# EAGLE design beaglebone black cape (EAGLE 6.6.0)

## Sheet 1 of 3
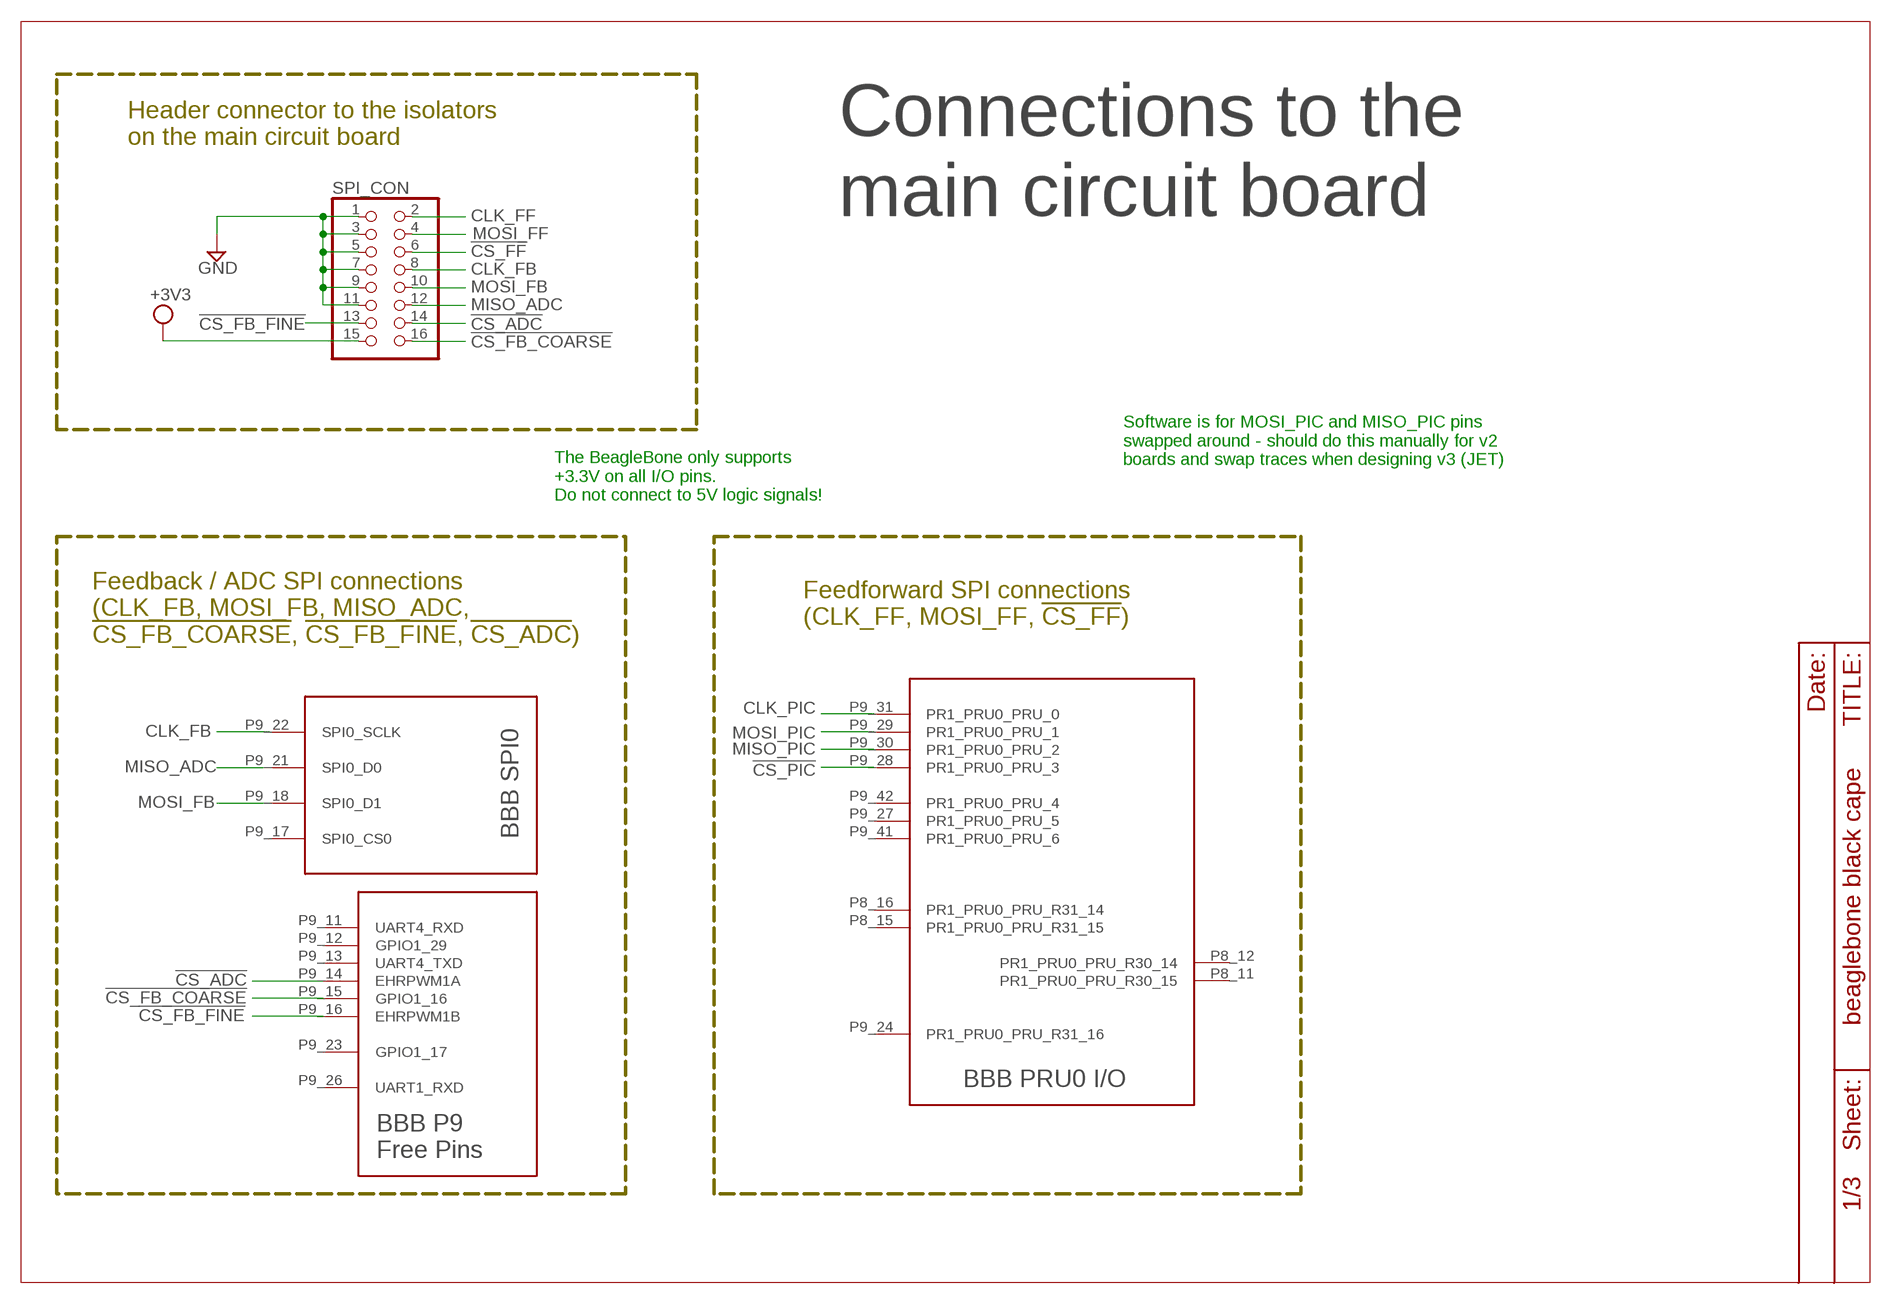
[diagram p0: schematic, sheet 1]

### Parts
SPI_CON  HEADER-2X8  [HEADER-2X8-BOX]
U$1  BEAGLEBONE_BLACK  [BEAGLEBONE_BLACK]

### Nets
3V3: SPI_CON.15 ; supply symbol labelled +3V3 ; also sheet 2,3
!CS_ADC: SPI_CON.14 U$1.P9_14(EHRPWM1A)
!CS_FB_COARSE: SPI_CON.16 U$1.P9_15(GPIO1_16)
!CS_FB_FINE: SPI_CON.13 U$1.P9_16(EHRPWM1B)
!CS_FF: SPI_CON.6 ; also sheet 3
!CS_PIC: U$1.P9_28(PR1_PRU0_PRU_3)
CLK_FB: SPI_CON.8 U$1.P9_22(SPI0_SCLK)
CLK_FF: SPI_CON.2 ; also sheet 3
CLK_PIC: U$1.P9_31(PR1_PRU0_PRU_0) ; also sheet 3
GND: SPI_CON.1 SPI_CON.3 SPI_CON.5 SPI_CON.7 SPI_CON.9 SPI_CON.11 ; also sheet 2,3
MISO_ADC: SPI_CON.12 U$1.P9_21(SPI0_D0)
MISO_PIC: U$1.P9_30(PR1_PRU0_PRU_2) ; also sheet 3
MOSI_FB: SPI_CON.10 U$1.P9_18(SPI0_D1)
MOSI_FF: SPI_CON.4 ; also sheet 3
MOSI_PIC: U$1.P9_29(PR1_PRU0_PRU_1) ; also sheet 3
Unconnected: U$1.P8_3(MMC1_DAT6) U$1.P8_4(MMC1_DAT7) U$1.P8_5(MMC1_DAT2) U$1.P8_6(MMC1_DAT3) U$1.P8_7(TIMER4) U$1.P8_8(TIMER7) U$1.P8_9(TIMER5) U$1.P8_10(TIMER6) U$1.P8_11(PR1_PRU0_PRU_R30_15) U$1.P8_12(PR1_PRU0_PRU_R30_14) U$1.P8_13(EHRPWM2B) U$1.P8_14(GPIO0_26) U$1.P8_15(PR1_PRU0_PRU_R31_15) U$1.P8_16(PR1_PRU0_PRU_R31_14) U$1.P8_17(GPIO0_27) U$1.P8_18(GPIO2_1) U$1.P8_19(EHRPWM2A) U$1.P8_20(MMC1_CMD) U$1.P8_21(MMC1_CLK) U$1.P8_22(MMC1_DAT5) U$1.P8_23(MMC1_DAT4) U$1.P8_24(MMC1_DAT1) U$1.P8_25(MMC1_DAT0) U$1.P8_26(GPIO1_29) U$1.P8_27(LCD_VSYNC) U$1.P8_28(LCD_PCLK) U$1.P8_29(LCD_HSYNC) U$1.P8_30(LCD_AC_BIAS_EN) U$1.P8_31(LCD_DATA14) U$1.P8_32(LCD_DATA15) U$1.P8_33(LCD_DATA13) U$1.P8_34(LCD_DATA11) U$1.P8_35(LCD_DATA12) U$1.P8_36(LCD_DATA10) U$1.P8_37(LCD_DATA8) U$1.P8_38(LCD_DATA9) U$1.P8_39(LCD_DATA6) U$1.P8_40(LCD_DATA7) U$1.P8_41(LCD_DATA4) U$1.P8_42(LCD_DATA5) U$1.P8_43(LCD_DATA2) U$1.P8_44(LCD_DATA3) U$1.P8_45(LCD_DATA0) U$1.P8_46(LCD_DATA1) U$1.P9_11(UART4_RXD) U$1.P9_12(GPIO1_29) U$1.P9_13(UART4_TXD) U$1.P9_17(SPI0_CS0) U$1.P9_19(I2C2_SCL) U$1.P9_20(I2C2_SDA) U$1.P9_23(GPIO1_17) U$1.P9_24(PR1_PRU0_PRU_R31_16) U$1.P9_25(AUDIO_CLK_IN) U$1.P9_26(UART1_RXD) U$1.P9_27(PR1_PRU0_PRU_5) U$1.P9_33(AIN4) U$1.P9_35(AIN6) U$1.P9_36(AIN5) U$1.P9_37(AIN2) U$1.P9_38(AIN3) U$1.P9_39(AIN0) U$1.P9_40(AIN1) U$1.P9_41(PR1_PRU0_PRU_6) U$1.P9_42(PR1_PRU0_PRU_4)

### Notes on the sheet
- Header connector to the isolators 
  on the main circuit board
- Connections to the 
  main circuit board
- Software is for MOSI_PIC and MISO_PIC pins
  swapped around - should do this manually for v2
  boards and swap traces when designing v3 (JET)
- The BeagleBone only supports 
  +3.3V on all I/O pins. 
  Do not connect to 5V logic signals!
- Feedforward SPI connections
  (CLK_FF, MOSI_FF, !CS_FF!)
- Feedback / ADC SPI connections
  (CLK_FB, MOSI_FB, MISO_ADC, 
  !CS_FB_COARSE!, !CS_FB_FINE!, !CS_ADC!)

## Sheet 2 of 3
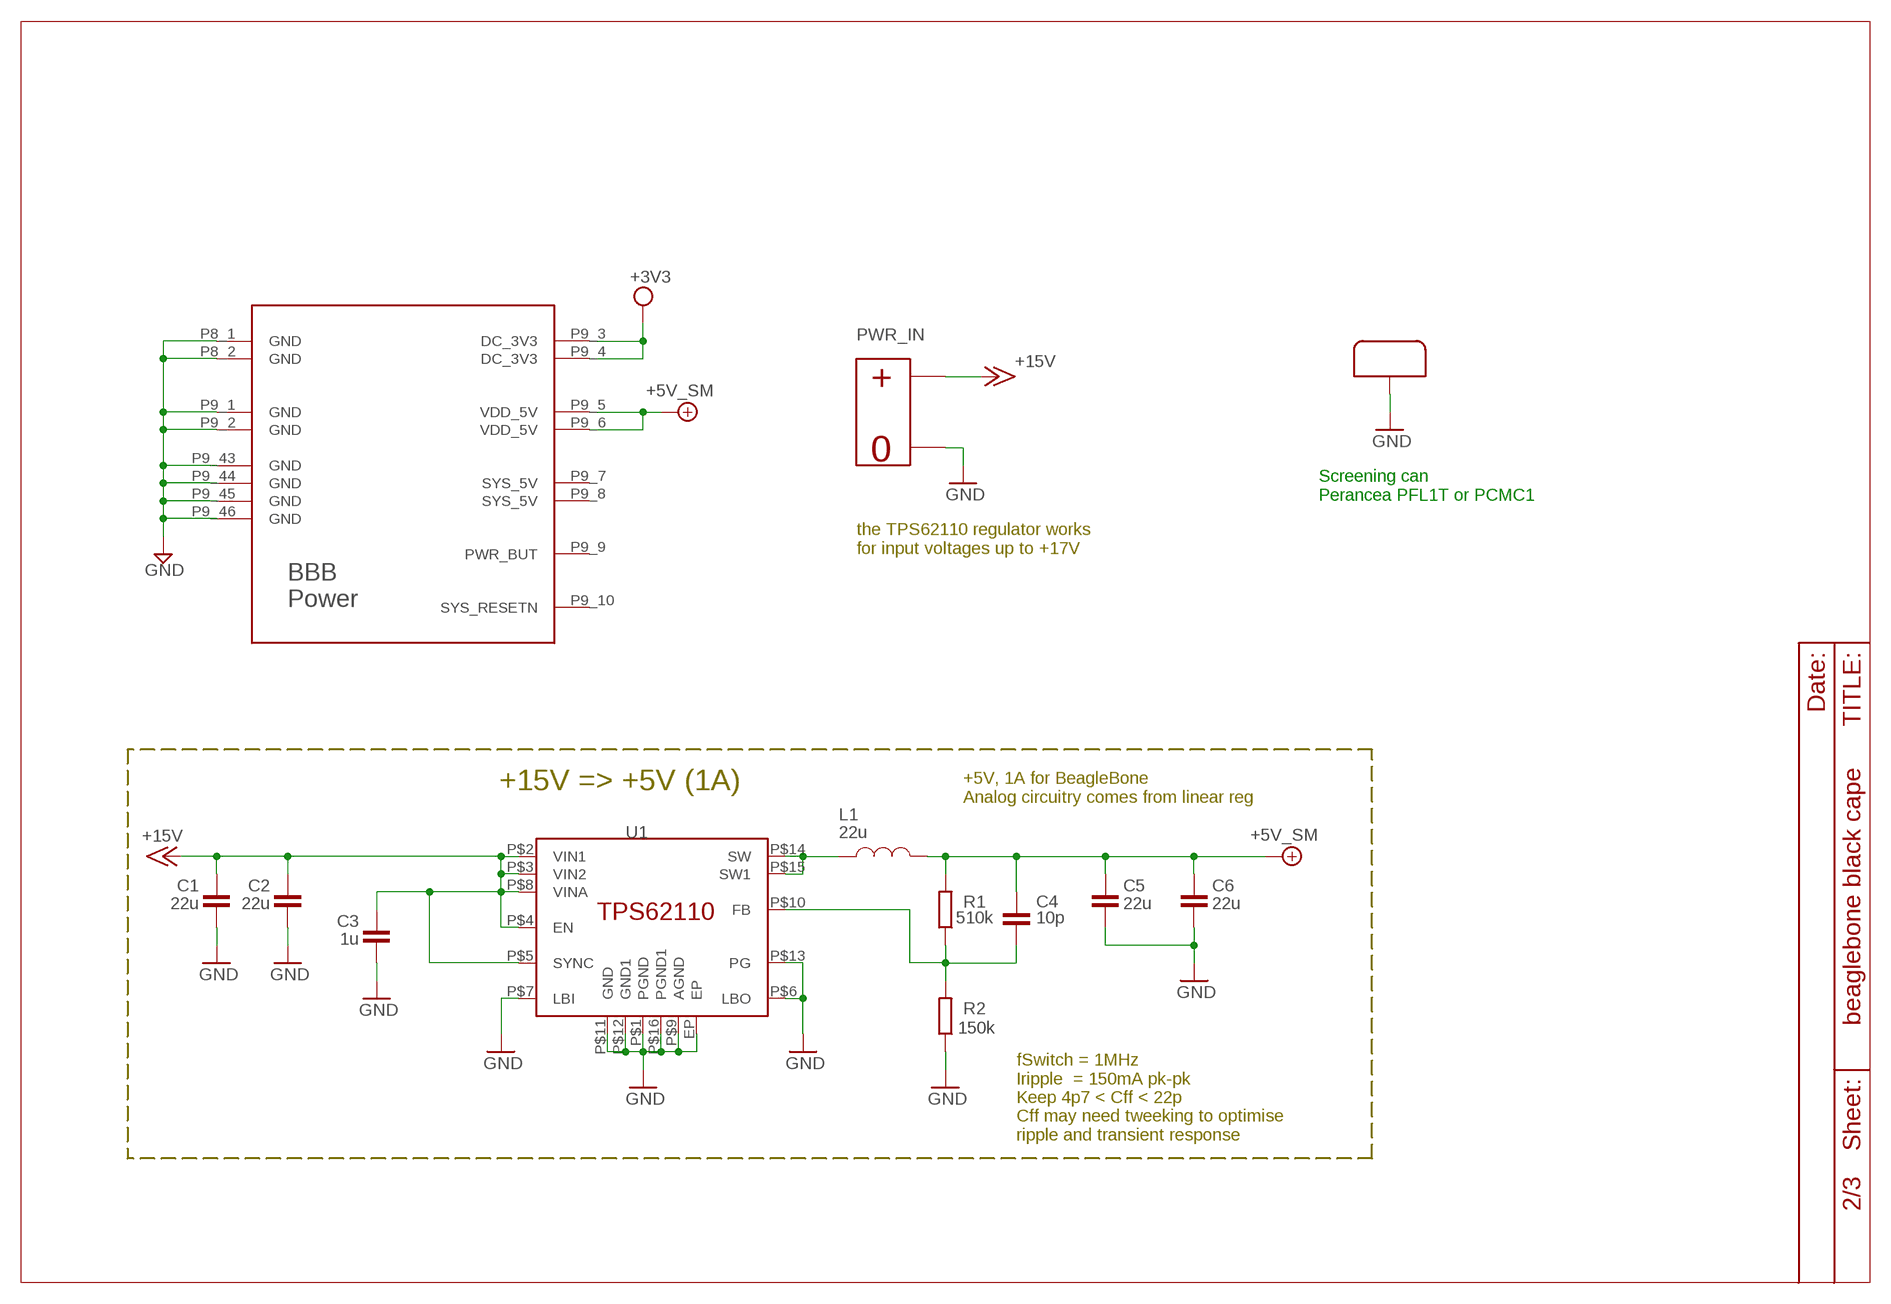
[diagram p1: schematic, sheet 2]

### Parts
C1  22u  CAP0805  [0805]
C2  22u  CAP0805  [0805]
C3  1u  CAP0805  [0805]
C4  10p  CAP0603  [0603]
C5  22u  CAP0805  [0805]
C6  22u  CAP0805  [0805]
L1  22u  INDUCTORXAL6060  [XAL6060]
PWR_IN  MOLEX_POWER_2PIN  [MOLEX-2PIN]
R1  510k  RES0603  [0603]
R2  150k  RES0603  [0603]
U1  TPS62110  [QFN16_4]
U$2  SCREENING_CAN  [SCREENING_CAN_20X20]

### Nets
3V3: U$1.P9_3(DC_3V3) U$1.P9_4(DC_3V3) ; supply symbol labelled +3V3 ; also sheet 1,3
+5VSM: C4.1 C5.1 C6.1 L1.P$2(P2) R1.2 U$1.P9_5(VDD_5V) U$1.P9_6(VDD_5V) ; supply symbol labelled +5V_SM
+15V: C1.1 C2.1 C3.1 PWR_IN.2(+) U1.P$2(VIN1) U1.P$3(VIN2) U1.P$4(EN) U1.P$5(SYNC) U1.P$8(VINA)
GND: C1.2 C2.2 C3.2 C5.2 C6.2 PWR_IN.1(GND) R2.1 U1.EP U1.P$1(PGND) U1.P$6(LBO) U1.P$7(LBI) U1.P$9(AGND) U1.P$11(GND) U1.P$12(GND1) U1.P$13(PG) U1.P$16(PGND1) U$1.P8_1(GND) U$1.P8_2(GND) U$1.P9_1(GND) U$1.P9_2(GND) U$1.P9_43(GND) U$1.P9_44(GND) U$1.P9_45(GND) U$1.P9_46(GND) U$2.1 U$2.2 U$2.3 U$2.4 ; also sheet 1,3
N$192: L1.P$1(P1) U1.P$14(SW) U1.P$15(SW1)
N$193: C4.2 R1.1 R2.2 U1.P$10(FB)

### Notes on the sheet
- Screening can
  Perancea PFL1T or PCMC1
- the TPS62110 regulator works 
  for input voltages up to +17V
- +15V => +5V (1A)
- +5V, 1A for BeagleBone
  Analog circuitry comes from linear reg
- fSwitch = 1MHz
  Iripple  = 150mA pk-pk
  Keep 4p7 < Cff < 22p
  Cff may need tweeking to optimise
  ripple and transient response

## Sheet 3 of 3
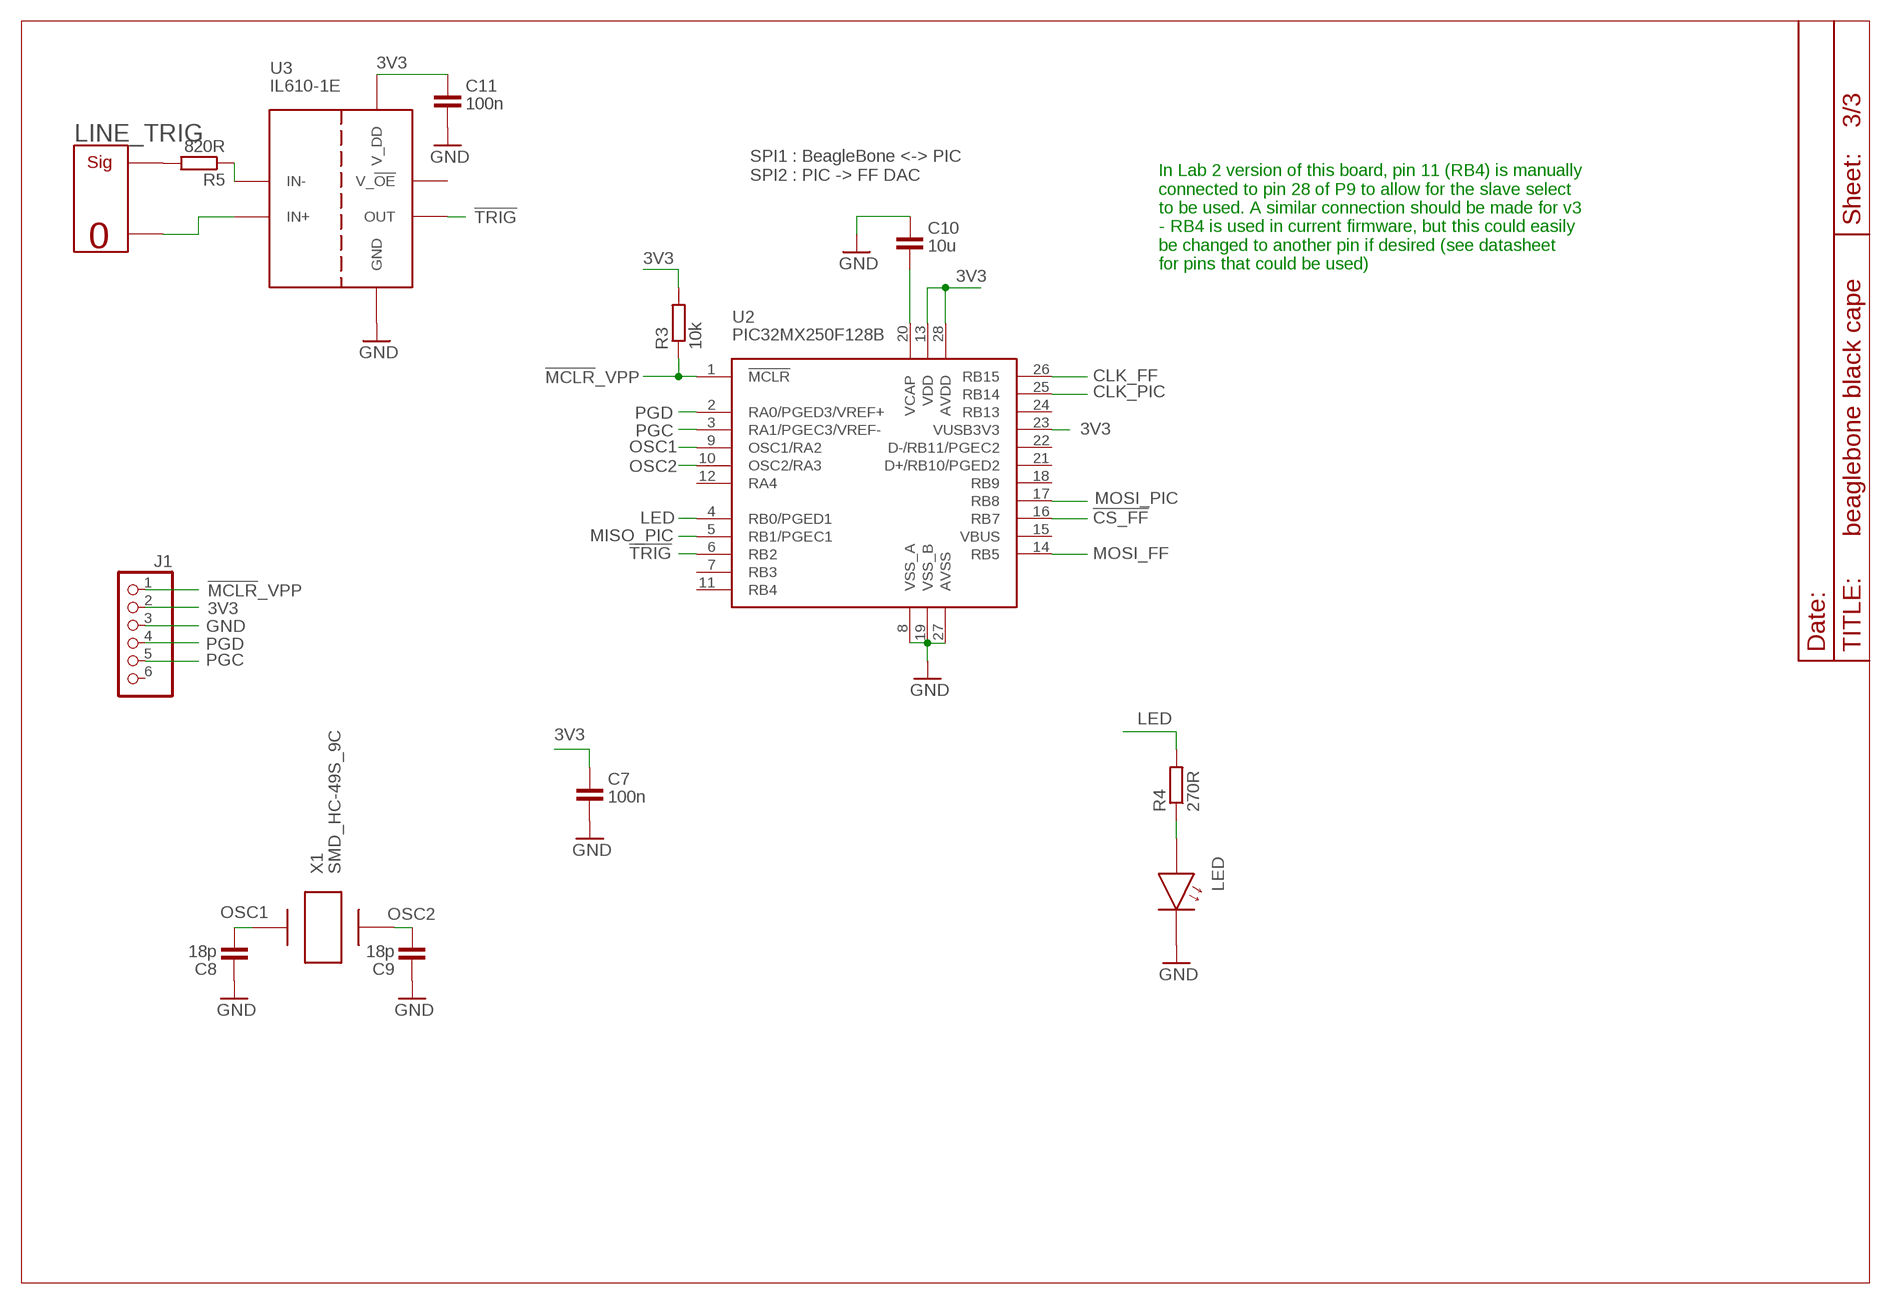
[diagram p2: schematic, sheet 3]

### Parts
C7  100n  CAP0603  [0603]
C8  18p  CAP0603  [0603]
C9  18p  CAP0603  [0603]
C10  10u  CAP0805  [0805]
C11  100n  CAP0603  [0603]
J1  HEADER-1X6  [1X06]
LED  OSRAMLED  [0805DIODE]
LINE_TRIG  MOLEX_SIG_2PIN  [MOLEX-2PIN]
R3  10k  RES0603  [0603]
R4  270R  RES0603  [0603]
R5  820R  RES0603  [0603]
U2  PIC32MX250F128B  [SSOP28]
U3  IL610-1E  [MSOP8]
X1  SMD_HC-49S_9C  [SMD_HC-49S_9C]

### Nets
3V3: C7.1 C11.1 J1.2 R3.2 U2.13(VDD) U2.23(VUSB3V3) U2.28(AVDD) U3.8(V_DD) ; also sheet 1,2
!CS_FF: U2.16(RB7) ; also sheet 1
!MCLR!_VPP: J1.1 R3.1 U2.1(!MCLR)
!TRIG: U2.6(RB2) U3.6(OUT)
CLK_FF: U2.26(RB15) ; also sheet 1
CLK_PIC: U2.25(RB14) ; also sheet 1
GND: C7.2 C8.1 C9.1 C10.1 C11.2 J1.3 LED.2 LINE_TRIG.1(GND) U2.8(VSS_A) U2.19(VSS_B) U2.27(AVSS) U3.2(IN+) U3.5(GND) ; also sheet 1,2
LED: R4.2 U2.4(RB0/PGED1)
MISO_PIC: U2.5(RB1/PGEC1) ; also sheet 1
MOSI_FF: U2.14(RB5) ; also sheet 1
MOSI_PIC: U2.17(RB8) ; also sheet 1
N$1: LED.1 R4.1
N$2: R5.1 U3.3(IN-)
N$7: LINE_TRIG.2(SIG) R5.2
OSC1: C8.2 U2.9(OSC1/RA2) X1.P$2
OSC2: C9.2 U2.10(OSC2/RA3) X1.P$1
PGC: J1.5 U2.3(RA1/PGEC3/VREF-)
PGD: J1.4 U2.2(RA0/PGED3/VREF+)
VCAP: C10.2 U2.20(VCAP)
Unconnected: J1.6 U2.7(RB3) U2.11(RB4) U2.12(RA4) U2.15(VBUS) U2.18(RB9) U2.21(D+/RB10/PGED2) U2.22(D-/RB11/PGEC2) U2.24(RB13) U3.7(V_!OE)

### Notes on the sheet
- SPI1 : BeagleBone <-> PIC
  SPI2 : PIC -> FF DAC
- In Lab 2 version of this board, pin 11 (RB4) is manually
  connected to pin 28 of P9 to allow for the slave select
  to be used. A similar connection should be made for v3
  - RB4 is used in current firmware, but this could easily
  be changed to another pin if desired (see datasheet
  for pins that could be used)

## Power pins joined to a net without a drawn wire
AGND: U$1.P9_34(AGND)
PWR_BUT: U$1.P9_9(PWR_BUT)
SYS_5V: U$1.P9_7(SYS_5V) U$1.P9_8(SYS_5V)
SYS_RESETN: U$1.P9_10(SYS_RESETN)
VADC: U$1.P9_32(VADC)

## Library data of the parts
C1-C11 = custom-passive:CAP: capacitor
J1 = custom-con:HEADER-1X6
L1 = custom-passive:INDUCTOR: Inductors, mainly Coilcraft.
LED = custom:OSRAMLED
LINE_TRIG = custom-con:MOLEX_SIG_2PIN: 2 pin Molex KK connector for 1 signal puls GND.
PWR_IN = custom-con:MOLEX_POWER_2PIN
R1-R5 = custom-passive:RES
SPI_CON = custom-con:HEADER-2X8
U1 = custom-ic:TPS62110: Texas Instruments TS62110 3.1V-17V input, 1.2V-16V out, 1.5A synchronous step-down DC-to-DC converter.
U2 = custom-ic:PIC32MX250F128B: Microcontroller (Farnell part number: 2382711)
U3 = custom-ic:IL610-1E: Single-channel isolator (Digikey part number: 390-1075-5-ND)
U$1 = custom-module:BEAGLEBONE_BLACK: BeagleBone Black cape with explicit support for eMMC, HDMI, IC2C, SPI0, and remaining PRU0 pins
U$2 = custom:SCREENING_CAN
X1 = custom-passive:SMD_HC-49S_9C: SMD HC-49S 9C series quartz crystal (e.g. Farnell part number: 1842314).

## Board
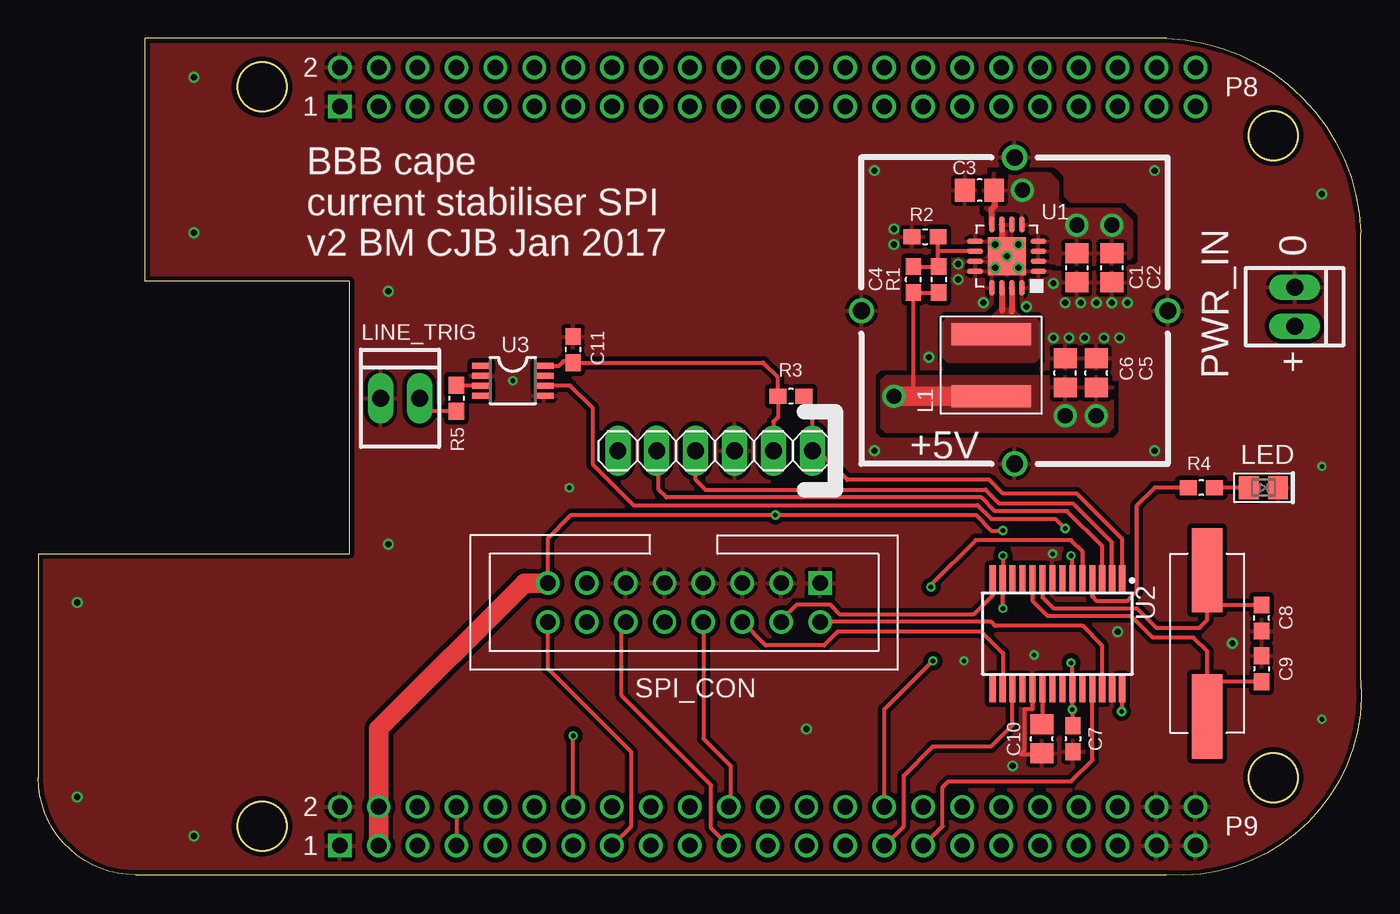
[diagram p3: board, top side]
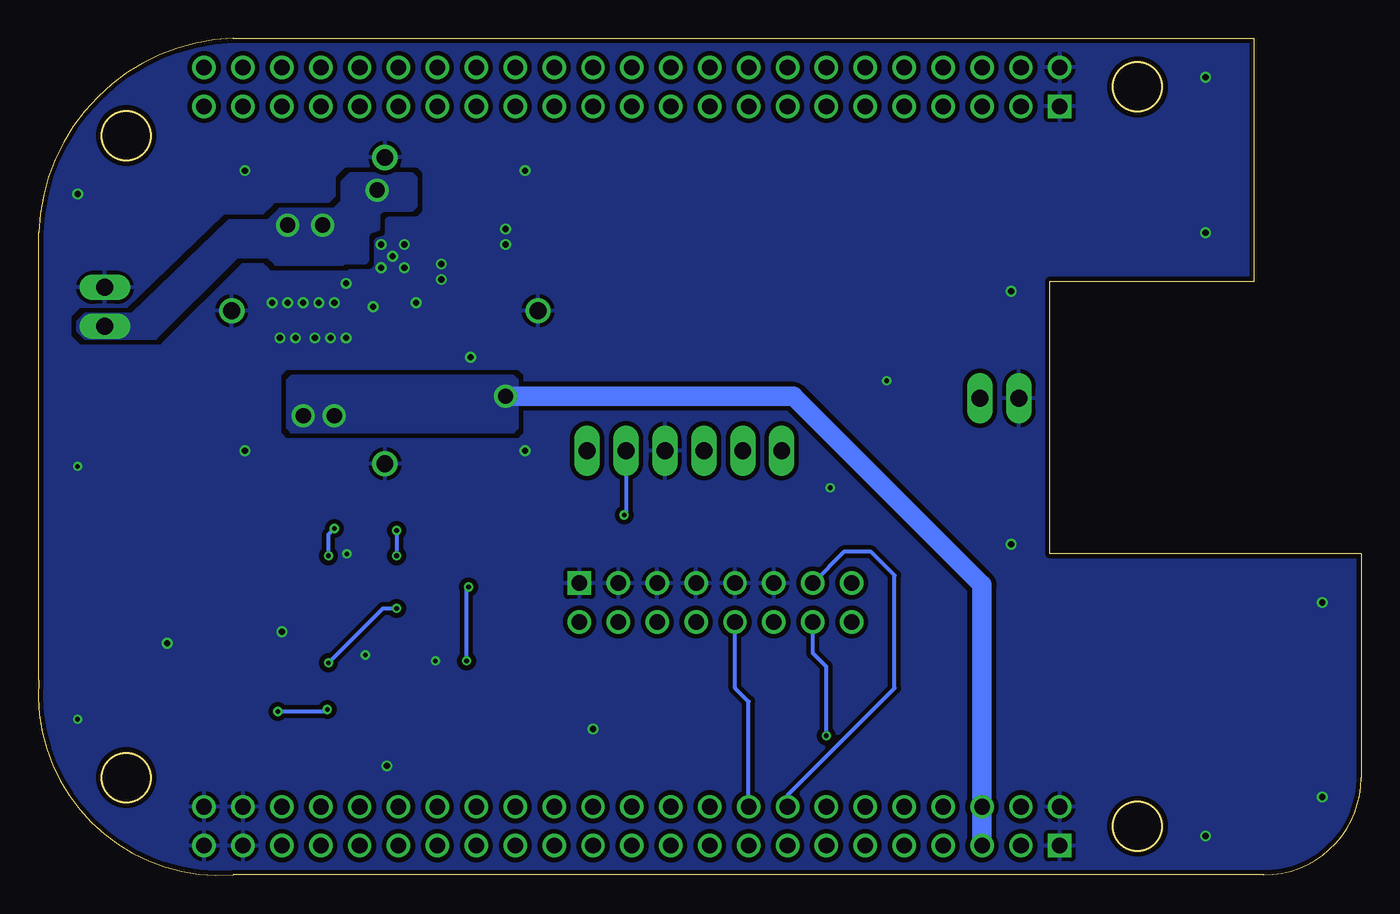
[diagram p4: board, bottom side, seen from below]

Size 86.39 x 54.64 mm. Coordinates in mm from the lower left corner, seen from the top.
Copper layers (1*16): Top 0.035mm / dielectric 1.5mm / Bottom 0.035mm
Design rules "ITEADstudio_DRC": minimum track width 6mil, minimum drill 0.3mm, track to track 6mil, track to pad 6mil, pad to pad 6mil, via to via 6mil, smd to smd 0mil, copper to edge 0.2mm, drill to drill 10mil, minimum pad ring 10mil, minimum via ring 6mil, stop-mask expansion 2mil, vias tented up to drill 100mil, thermal gap 10mil

### Footprints (pad centres in the part's own frame; a part is rotated, then mirrored left to right if it is on the bottom)
0805 = smd 1.3 x 1.5: 1 -0.95,0; 2 0.95,0
0603 = smd 1.1 x 1: 1 -0.85,0; 2 0.85,0
1X06 = drill 1.1 long: 1 -6.35,0; 2 -3.81,0; 3 -1.27,0; 4 1.27,0; 5 3.81,0; 6 6.35,0
XAL6060 = smd 1.43 x 5.18: P$1 -2.02,0; P$2 2.02,0
0805DIODE = smd 1.3 x 1.5: 1 -0.95,0; 2 0.95,0
MOLEX-2PIN = drill 1.1 long: 1 -1.27,0; 2 1.27,0
HEADER-2X8-BOX = drill 1.02 square: 1 -8.89,-1.27 | drill 1.02: 2 -8.89,1.27; 3 -6.35,-1.27; 4 -6.35,1.27; 5 -3.81,-1.27; 6 -3.81,1.27; 7 -1.27,-1.27; 8 -1.27,1.27; 9 1.27,-1.27; 10 1.27,1.27; 11 3.81,-1.27; 12 3.81,1.27; 13 6.35,-1.27; 14 6.35,1.27; 15 8.89,-1.27; 16 8.89,1.27
QFN16_4 = smd 2.5 x 2.5: EP 0,0 | smd 1.025 x 0.35: P$1 -2.062,0.975; P$2 -2.062,0.325; P$3 -2.062,-0.325; P$4 -2.062,-0.975; P$9 2.062,-0.975; P$10 2.062,-0.325; P$11 2.062,0.325; P$12 2.062,0.975 | smd 0.35 x 1.025: P$5 -0.975,-2.062; P$6 -0.325,-2.062; P$7 0.325,-2.062; P$8 0.975,-2.062; P$13 0.975,2.062; P$14 0.325,2.062; P$15 -0.325,2.062; P$16 -0.975,2.062
SSOP28 = smd 1.75 x 0.4: 1 -3.6,4.225; 2 -3.6,3.575; 3 -3.6,2.925; 4 -3.6,2.275; 5 -3.6,1.625; 6 -3.6,0.975; 7 -3.6,0.325; 8 -3.6,-0.325; 9 -3.6,-0.975; 10 -3.6,-1.625; 11 -3.6,-2.275; 12 -3.6,-2.925; 13 -3.6,-3.575; 14 -3.6,-4.225; 15 3.6,-4.225; 16 3.6,-3.575; 17 3.6,-2.925; 18 3.6,-2.275; 19 3.6,-1.625; 20 3.6,-0.975; 21 3.6,-0.325; 22 3.6,0.325; 23 3.6,0.975; 24 3.6,1.625; 25 3.6,2.275; 26 3.6,2.925; 27 3.6,3.575; 28 3.6,4.225
MSOP8 = smd 0.4 x 1.2: 1 -0.975,-2.05; 2 -0.325,-2.05; 3 0.325,-2.05; 4 0.975,-2.05; 5 0.975,2.05; 6 0.325,2.05; 7 -0.325,2.05; 8 -0.975,2.05
BEAGLEBONE_BLACK = drill 1.02 square: P8_1 19.685,50.165; P9_1 19.685,1.905 | drill 1.02: P8_2 19.685,52.705; P8_3 22.225,50.165; P8_4 22.225,52.705; P8_5 24.765,50.165; P8_6 24.765,52.705; P8_7 27.305,50.165; P8_8 27.305,52.705; P8_9 29.845,50.165; P8_10 29.845,52.705; P8_11 32.385,50.165; P8_12 32.385,52.705; P8_13 34.925,50.165; P8_14 34.925,52.705; P8_15 37.465,50.165; P8_16 37.465,52.705; P8_17 40.005,50.165; P8_18 40.005,52.705; P8_19 42.545,50.165; P8_20 42.545,52.705; P8_21 45.085,50.165; P8_22 45.085,52.705; P8_23 47.625,50.165; P8_24 47.625,52.705; P8_25 50.165,50.165; P8_26 50.165,52.705; P8_27 52.705,50.165; P8_28 52.705,52.705; P8_29 55.245,50.165; P8_30 55.245,52.705; P8_31 57.785,50.165; P8_32 57.785,52.705; P8_33 60.325,50.165; P8_34 60.325,52.705; P8_35 62.865,50.165; P8_36 62.865,52.705; P8_37 65.405,50.165; P8_38 65.405,52.705; P8_39 67.945,50.165; P8_40 67.945,52.705; P8_41 70.485,50.165; P8_42 70.485,52.705; P8_43 73.025,50.165; P8_44 73.025,52.705; P8_45 75.565,50.165; P8_46 75.565,52.705; P9_2 19.685,4.445; P9_3 22.225,1.905; P9_4 22.225,4.445; P9_5 24.765,1.905; P9_6 24.765,4.445; P9_7 27.305,1.905; P9_8 27.305,4.445; P9_9 29.845,1.905; P9_10 29.845,4.445; P9_11 32.385,1.905; P9_12 32.385,4.445; P9_13 34.925,1.905; P9_14 34.925,4.445; P9_15 37.465,1.905; P9_16 37.465,4.445; P9_17 40.005,1.905; P9_18 40.005,4.445; P9_19 42.545,1.905; P9_20 42.545,4.445; P9_21 45.085,1.905; P9_22 45.085,4.445; P9_23 47.625,1.905; P9_24 47.625,4.445; P9_25 50.165,1.905; P9_26 50.165,4.445; P9_27 52.705,1.905; P9_28 52.705,4.445; P9_29 55.245,1.905; P9_30 55.245,4.445; P9_31 57.785,1.905; P9_32 57.785,4.445; P9_33 60.325,1.905; P9_34 60.325,4.445; P9_35 62.865,1.905; P9_36 62.865,4.445; P9_37 65.405,1.905; P9_38 65.405,4.445; P9_39 67.945,1.905; P9_40 67.945,4.445; P9_41 70.485,1.905; P9_42 70.485,4.445; P9_43 73.025,1.905; P9_44 73.025,4.445; P9_45 75.565,1.905; P9_46 75.565,4.445
SCREENING_CAN_20X20 = drill 1.1: 1 -10,0; 2 0,-10; 3 10,0; 4 0,10
SMD_HC-49S_9C = smd 5.5 x 2: P$1 -4.775,0; P$2 4.775,0

### Placement (x,y rotation side)
C1  67.82,39.65 270 top
C2  70.1,39.65 270 top
C3  61.47,44.73 180 top
C4  57.15,38.89 90 top
C5  69.09,32.8 90 top
C6  67.06,32.8 90 top
C7  67.56,8.92 270 top
C8  79.88,16.79 90 top
C9  79.88,13.49 270 top
C10  65.53,8.92 90 top
C11  34.92,34.32 90 top
J1  44.2,27.72 180 top
L1  62.23,33.3 270 top
LED  80.01,25.3 0 top
LINE_TRIG  23.62,31.15 0 top
PWR_IN  82.04,37.11 270 top
R1  58.8,38.89 270 top
R2  57.91,41.69 0 top
R3  49.15,31.27 180 top
R4  75.95,25.3 180 top
R5  27.3,31.15 270 top
SPI_CON  42.16,17.81 180 top
U1  63.25,40.42 180 top
U2  66.55,15.78 270 top
U3  30.99,32.29 270 top
U$1  0,0.03 0 top
U$2  63.75,36.86 0 top
X1  76.33,15.14 90 top

### Tracks (layer width: path | path; a pad name or v marks a point on that pad's centre or on a via)
3V3  (via drill 0.3)
  Top 0.254: C7.1 67.52,9.81 v67.52,10.83 U2.23 67.52,13.79 v67.44,13.87 | U2.28 70.77,10.73 v70.74,10.7 | v62.99,17.43 62.97,17.45 U2.13 62.99,19.4 v62.99,20.86 | J1.2 48.01,29.62 48.3,29.91 R3.2 48.26,31.31 48.26,32.54 47.33,33.47 C11.1 34.84,33.56 34.29,33.56 33.99,33.26 U3.8 | v62.99,22.51 62.23,22.51 61.21,23.53 v48.13,23.53 34.8,23.53 33.27,22 SPI_CON.15
  Top 1.27: SPI_CON.15 31.75,19.08 22.23,9.56 U$1.P9_4 U$1.P9_3
  Bottom 0.254: J1.2 48.01,23.65 v48.13,23.53 | v70.74,10.7 67.65,10.7 v67.52,10.83 | v67.44,13.87 63.88,17.43 v62.99,17.43 | v62.99,22.51 v62.99,20.86
!CS_ADC  (via drill 0.3)
  Top 0.254: U$1.P9_14 v34.92,9.11
  Bottom 0.254: v34.92,9.11 34.92,13.62 35.81,14.51 SPI_CON.14
!CS_FB_COARSE
  Top 0.254: U$1.P9_15 38.73,3.21 38.73,8.03 33.27,13.49 SPI_CON.16
!CS_FB_FINE
  Bottom 0.254: SPI_CON.13 33.78,21.11 32,21.11 30.48,19.59 30.48,12.22 37.47,5.24 U$1.P9_16
!CS_FF
  Top 0.254: SPI_CON.6 47.5,15.02 51.31,15.02 52.2,15.91 61.59,15.91 62.99,14.51 62.99,12.2 U2.16
!MCLR!_VPP
  Top 0.254: U2.1 70.77,21.97 67.82,24.92 62.99,24.92 62.1,25.81 52.83,25.81 50.93,27.72 J1.1 50.55,29.75 50.04,30.26 50.04,31.23 R3.1
!TRIG  (via drill 0.3)
  Top 0.254: v67.06,22.64 66.42,23.27 62.23,23.27 61.34,24.16 38.86,24.16 36.2,26.83 36.2,30.51 34.73,31.97 U3.6 | U2.6 67.52,20.77 v67.44,20.86
  Bottom 0.254: v67.44,20.86 67.44,22.26 v67.06,22.64
+5VSM  (via drill 1)
  Top 0.254: R1.2 C4.1 57.15,31.28 | L1.P$2 59.93,31.28
  Top 1.27: v55.88,31.27 55.89,31.28 57.15,31.28 59.93,31.28
  Bottom 1.27: U$1.P9_5 U$1.P9_6 24.77,18.95 37.08,31.27 v55.88,31.27
  other vias: 67.06,30 69.09,30
  pour Top (isolate 0.305, rank 2): 55.37,32.54 69.85,32.54 70.1,32.29 70.1,29.24 69.85,28.99 55.37,28.99 55.12,29.24 55.12,32.29
  pour Bottom (isolate 0.305): 55.37,32.54 69.85,32.54 70.1,32.29 70.1,29.24 69.85,28.99 55.37,28.99 55.12,29.24 55.12,32.29
  pour Top (no thermals): 58.93,32.35 65.53,32.35 65.53,30 59.18,30 58.93,30.26
+15V  (via drill 1)
  Top 0.406: U1.P$8 62.27,43.5 62.48,43.72 62.48,44.41 C3.1
  other vias: 64.26,44.73 67.82,42.45 70.1,42.45
  pour Top (isolate 0.305): 65.02,40.04 66.42,40.04 66.55,39.91 70.87,39.91 71.37,40.42 71.37,42.7 70.61,43.46 67.06,43.46 66.55,43.97 66.55,45.24 66.04,45.75 61.98,45.75 61.72,45.5 61.72,43.72 61.98,43.46 63.88,43.46 64.2,43.15 64.2,42.19 64.64,42.07 64.9,41.81 64.9,40.16
  pour Bottom (isolate 0.305): 61.98,45.75 66.04,45.75 66.55,45.24 66.55,43.97 67.06,43.46 70.61,43.46 71.37,42.7 71.37,40.42 70.87,39.91 66.55,39.91 66.42,40.04 65.02,40.04 64.9,40.16 64.9,41.81 64.64,42.07 64.55,42.09 64.17,42.22 64.17,43.19 63.88,43.46 61.98,43.46 61.72,43.72 61.72,45.5
  pour Bottom (isolate 0.305, no thermals): 80.26,36.61 83.31,36.61 83.82,36.1 83.82,35.59 83.31,35.08 78.74,35.08 73.41,40.42 71.37,40.42 71.37,42.7 73.91,42.7
CLK_FB
  Top 0.254: SPI_CON.8 43.43,8.92 45.21,7.14 45.21,4.6 U$1.P9_22
CLK_FF
  Top 0.254: U2.26 69.47,15.02 68.2,16.29 62.48,16.29 62.23,16.54 SPI_CON.2
CLK_PIC
  Top 0.254: U$1.P9_31 59.05,3.21 59.05,5.75 59.44,6.13 67.44,6.13 68.83,7.52 68.83,12.17 U2.25
GND  (via drill 0.3, 0.4)
  Top 0.254: U2.19 64.92,10.85 64.9,10.83 64.39,10.83 64.39,8.16 64.14,7.9 65.47,7.9 C10.1
  Top 0.406: U1.P$7 62.92,41.62 v62.48,41.18
  other vias: 2.54,17.81 2.54,5.11 10.16,2.57 10.16,52.1 10.16,41.94 22.86,38.13 22.86,21.62 83.82,44.48 83.82,10.19 83.82,26.7 72.9,27.72 54.61,27.72 54.61,46 72.9,46 64.01,41.18 64.01,39.65 62.48,39.65 63.25,40.42 55.88,42.19 55.88,41.18 61.72,37.37 60.07,39.91 64.52,37.11 66.29,38.64 67.06,37.37 68.07,37.37 69.09,37.37 70.1,37.37 71.12,37.37 66.29,35.08 67.31,35.08 68.33,35.08 69.6,35.08 70.61,35.08 60.07,38.89 58.17,33.81 65.02,14.38 66.23,20.99 60.45,14 34.67,25.3 30.99,32.29 50.16,9.56 63.63,7.14 77.98,15.14 70.48,15.91
  pour Top (isolate 0.305, rank 3): 0,54.64 86.36,54.64 86.36,0.03 0,0.03
  pour Bottom (isolate 0.305, rank 3): 0,54.64 86.36,54.64 86.36,0.03 0,0.03
LED
  Top 0.254: U2.4 68.82,18.2 69.09,17.94 71.12,17.94 71.75,18.57 71.75,24.16 72.9,25.3 R4.2
MISO_ADC
  Top 0.254: U$1.P9_21 43.94,3.08 43.94,5.87 38.1,11.71 38.1,16.29 SPI_CON.12
MISO_PIC  (via drill 0.3)
  Top 0.254: U$1.P9_30 55.24,10.83 v58.42,14 | v58.29,18.83 58.29,18.95 61.21,21.87 67.44,21.87 68.2,21.11 68.2,19.4 U2.5
  Bottom 0.254: v58.42,14 58.42,18.7 v58.29,18.83
MOSI_FB
  Bottom 0.254: U$1.P9_18 40.01,11.33 40.89,12.22 SPI_CON.10
MOSI_FF
  Top 0.254: SPI_CON.4 48.51,16.67 49.53,17.68 51.69,17.68 52.32,17.05 61.09,17.05 62.32,18.28 U2.14
MOSI_PIC
  Top 0.254: U$1.P9_29 56.52,3.21 56.52,6.51 58.42,8.41 62.23,8.41 63.63,9.81 U2.17
N$1
  Top 0.254: LED.1 R4.1
N$2
  Top 0.254: U3.3 27.34,31.96 R5.1
N$7
  Top 0.254: R5.2 25.74,30.3 LINE_TRIG.2
N$192
  Top 0.254: U1.P$15 | U1.P$14
  Top 0.406: U1.P$15 63.56,36.8 | U1.P$14 62.93,36.86
  pour Top (isolate 0.305, no thermals): 63.63,36.99 64.26,36.35 65.02,36.35 65.28,36.1 65.28,33.81 65.02,33.56 59.44,33.56 59.18,33.81 59.18,36.1 59.44,36.35 62.23,36.35 62.87,36.99
N$193
  Top 0.254: 58.76,40.74 58.76,39.53 R1.1 C4.2 | 58.76,40.74 R2.2 | U1.P$10 58.76,40.74
OSC1
  Top 0.254: U2.9 65.57,18.15 66.29,17.43 71.75,17.43 73.03,16.16 75.82,16.16 76.33,16.67 76.33,17.81 | 76.33,17.81 X1.P$2 | C8.2 76.49,17.64 76.33,17.81
OSC2
  Top 0.254: U2.10 64.92,17.91 65.91,16.92 71.37,16.92 72.77,15.52 75.44,15.52 76.33,14.64 76.33,12.22 | X1.P$1 76.33,12.22 | C9.2 76.75,12.64 76.33,12.22
PGC
  Top 0.254: U2.3 69.47,21.49 67.18,23.78 62.48,23.78 61.59,24.67 41.02,24.67 40.51,25.18 40.51,27.59 J1.5
PGD
  Top 0.254: U2.2 70.12,21.73 67.56,24.29 62.74,24.29 61.85,25.18 43.56,25.18 42.93,25.81 J1.4
SYS_5V
  Top 0.254: U$1.P9_8 U$1.P9_7
VCAP
  Top 0.254: U2.20 65.57,9.91 C10.2

### Text on the board
tPlace: 2 | 1 | BBB cape / current stabiliser SPI / v2 BM CJB Jan 2017 | 0 | + | +5V | 2 | 1